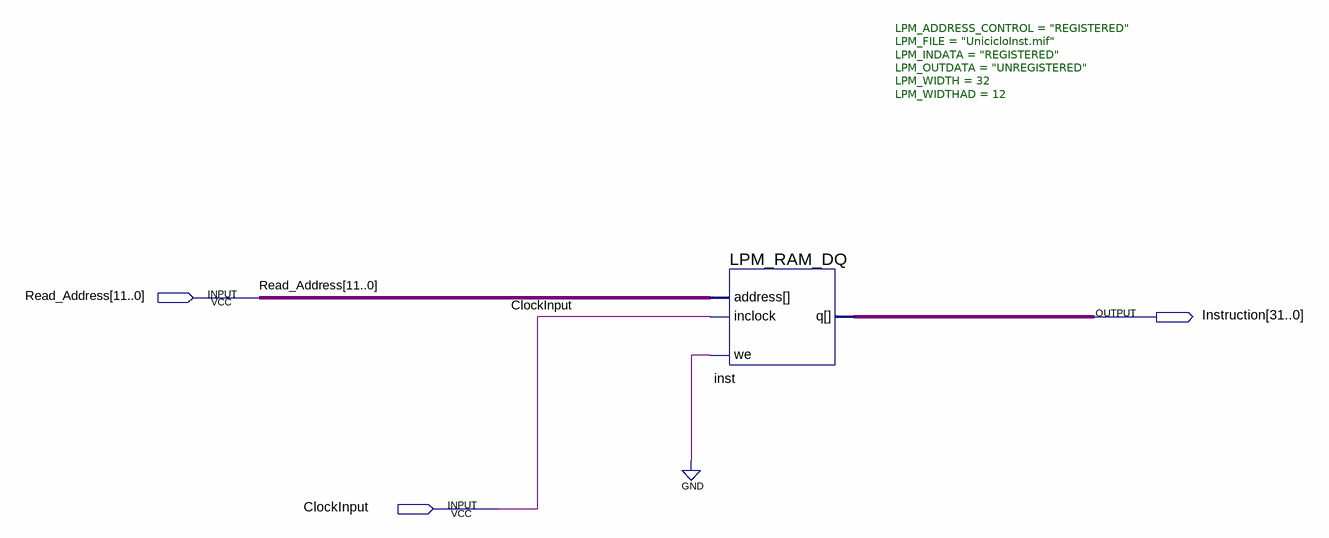
[diagram p0: schematic sheet]
// Quartus schematic instructionsmemory.bdf as structural Verilog: 1 symbols, 3 pins
module instructionsmemory (
  input  [11:0] Read_Address,
  input  ClockInput,
  output [31:0] Instruction
);

  LPM_RAM_DQ #(.LPM_ADDRESS_CONTROL("REGISTERED"), .LPM_FILE("UnicicloInst.mif"), .LPM_INDATA("REGISTERED"), .LPM_OUTDATA("UNREGISTERED"), .LPM_WIDTH(32), .LPM_WIDTHAD(12)) inst (
    .address(Read_Address), .inclock(ClockInput), .we(1'b0), .q(Instruction));
endmodule
